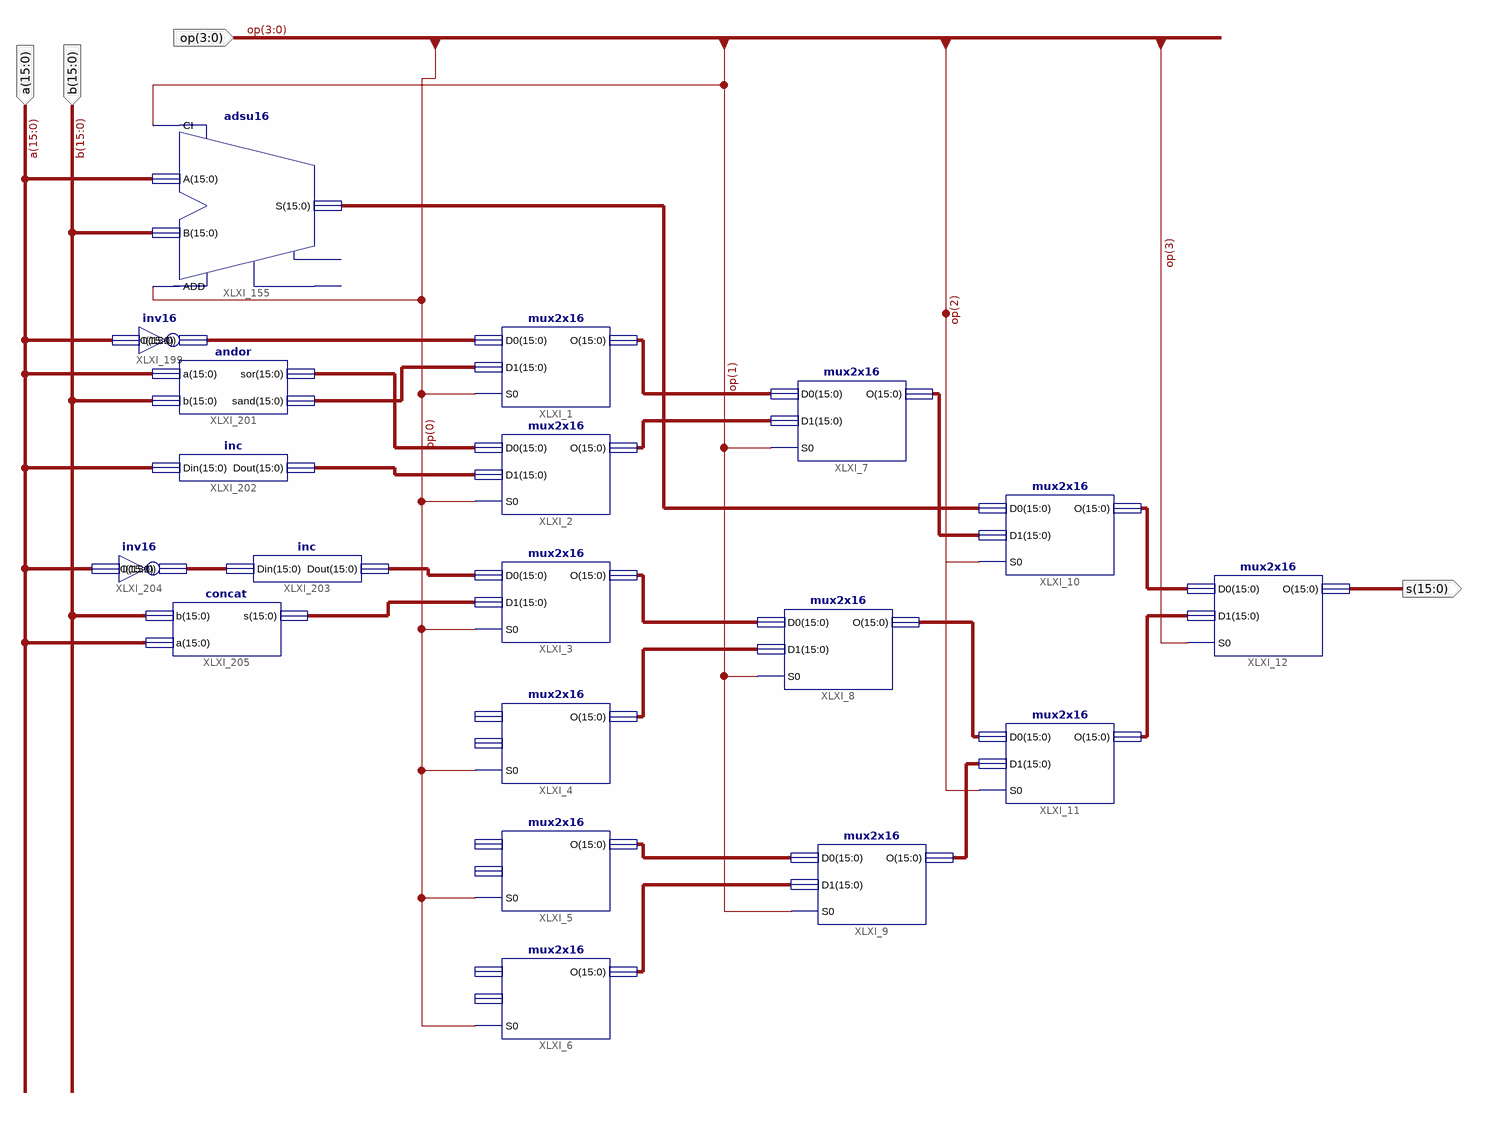
[diagram p0: schematic sheet 1]
// Xilinx ISE schematic ALU.sch (spartan3e) as structural Verilog: 19 symbols, 4 ports
module ALU (
  input  [3:0] op,
  input  [15:0] a,
  input  [15:0] b,
  output [15:0] s
);

  wire [15:0] XLXN_4, XLXN_5, XLXN_6, XLXN_7, XLXN_8, XLXN_9, XLXN_10, XLXN_11, XLXN_12, XLXN_13, XLXN_14,
       XLXN_220, XLXN_308, XLXN_309, XLXN_310, XLXN_311, XLXN_312, XLXN_313, XLXN_314;

  adsu16 XLXI_155 (.A(a), .ADD(op[0]), .B(b), .CI(op[1]), .S(XLXN_220));  // open: CO, OFL
  mux2x16 XLXI_12 (.D0(XLXN_14), .D1(XLXN_13), .S0(op[3]), .O(s));
  mux2x16 XLXI_6 (.S0(op[0]), .O(XLXN_9));  // open: D0, D1
  mux2x16 XLXI_5 (.S0(op[0]), .O(XLXN_8));  // open: D0, D1
  mux2x16 XLXI_4 (.S0(op[0]), .O(XLXN_7));  // open: D0, D1
  mux2x16 XLXI_3 (.D0(XLXN_312), .D1(XLXN_314), .S0(op[0]), .O(XLXN_6));
  mux2x16 XLXI_2 (.D0(XLXN_309), .D1(XLXN_311), .S0(op[0]), .O(XLXN_5));
  mux2x16 XLXI_1 (.D0(XLXN_308), .D1(XLXN_310), .S0(op[0]), .O(XLXN_4));
  mux2x16 XLXI_8 (.D0(XLXN_6), .D1(XLXN_7), .S0(op[1]), .O(XLXN_11));
  mux2x16 XLXI_7 (.D0(XLXN_4), .D1(XLXN_5), .S0(op[1]), .O(XLXN_10));
  mux2x16 XLXI_9 (.D0(XLXN_8), .D1(XLXN_9), .S0(op[1]), .O(XLXN_12));
  mux2x16 XLXI_10 (.D0(XLXN_220), .D1(XLXN_10), .S0(op[2]), .O(XLXN_14));
  mux2x16 XLXI_11 (.D0(XLXN_11), .D1(XLXN_12), .S0(op[2]), .O(XLXN_13));
  inv16 XLXI_199 (.I(a), .O(XLXN_308));
  andor XLXI_201 (.a(a), .b(b), .sor(XLXN_309), .sand(XLXN_310));
  inc XLXI_202 (.Din(a), .Dout(XLXN_311));
  inc XLXI_203 (.Din(XLXN_313), .Dout(XLXN_312));
  inv16 XLXI_204 (.I(a), .O(XLXN_313));
  concat XLXI_205 (.a(a), .b(b), .s(XLXN_314));
endmodule
